# Altium project PCB_tiny_dot.PrjPcb
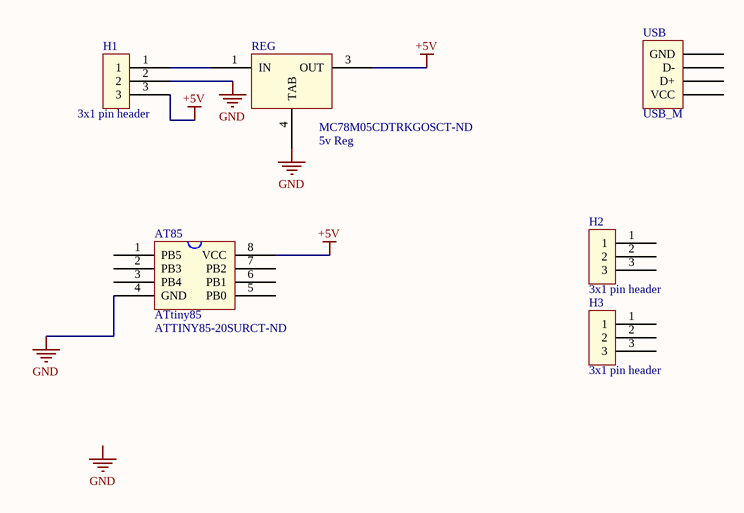
[diagram p0: Sheet_tiny_dot.SchDoc]
1 sheet, 6 parts. Net scope: global (net labels, ports and power ports of the same name join across sheets).
Board file: tiny_dot.PcbDoc

## Sheet Sheet_tiny_dot.SchDoc
size A4

### Parts
AT85  ATtiny85  Supplier Part Number 1: ATTINY85-20SURCT-ND  [SOIC127P800X216-8N]
H1  3x1 pin header  [3x1 100mil header 1m diam]
H2  3x1 pin header  [3x1 100mil header 1m diam]
H3  3x1 pin header  [3x1 100mil header 1m diam]
REG  5v Reg  Supplier Part Number 1: MC78M05CDTRKGOSCT-ND
USB  USB_M  [InlineUSB]

### Nets
+5V: AT85.8(VCC) H1.3 REG.3(OUT)
GND: AT85.4(GND) H1.2 REG.4(TAB)
NetH1_1: H1.1 REG.1(IN)

Not connected (* = marked no-connect by the designer): AT85 1(PB5) 2(PB3) 3(PB4) 5(PB0) 6(PB1) 7(PB2); H2 1 2 3; H3 1 2 3; USB D+ D- GND VCC

### Notes on the sheet
- Labels drawn without touching a wire or pin: GND

### Library data of the parts
AT85 = ATtiny85: Supplier 1: Digi-Key
REG = 5v Reg: Supplier 1: Digi-Key